# Altium project MSXII_DriverControls_Peripheral.PrjPcb
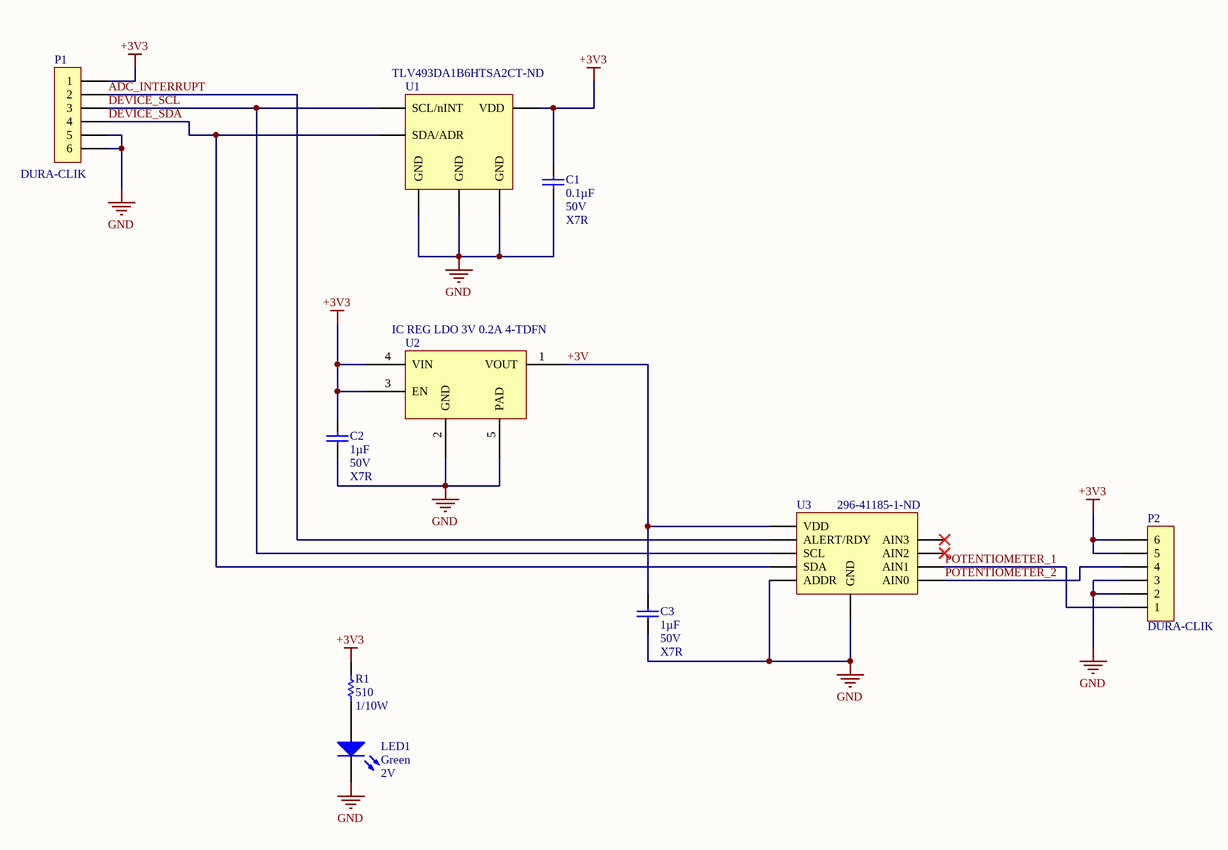
[diagram p0: DriverControls_PeripheralMain.SchDoc]
2 sheets, 10 parts. Net scope: global (net labels, ports and power ports of the same name join across sheets).
Board file: DriverControls_PeripheralPCB.PcbDoc
Sheets:
  DriverControls_PeripheralMain.SchDoc
  DriverControls_PeriphealBlockDiagram.SchDoc

## Sheet DriverControls_PeripheralMain.SchDoc: Peripheral Board
size Letter; Revision: 1.23; SheetNumber: 2; SheetTotal: 2

### Parts
C1  Capacitance: 0.1µF  Voltage: 50V  Temperature Coefficient: X7R  [CAP, 0603]  (hidden comment: CAP CER 0.1UF 50V 10% X7R 0603)
C2  Capacitance: 1µF  Voltage: 50V  Temperature Coefficient: X7R  [CAP, 0603]  (hidden comment: CAP CER 1UF 50V 10% X7R 0603)
C3  Capacitance: 1µF  Voltage: 50V  Temperature Coefficient: X7R  [CAP, 0603]  (hidden comment: CAP CER 1UF 50V 10% X7R 0603)
LED1  Color: Green  Voltage - Forward (Vf) (Typ): 2V  [LED_0603]  (hidden comment: LED GREEN CLEAR 2V 0603)
P1  DURA-CLIK  [CONN, 6POS DURA-CLIK VERT]
P2  DURA-CLIK  [CONN, 6POS DURA-CLIK VERT]
R1  Resistance: 510  Power: 1/10W  [RES, 0603]  (hidden comment: RES 510 OHM 5% 1/10W 0603)
U1  Supplier Part Number 1: TLV493DA1B6HTSA2CT-ND  [IC TLV496D MAG SENSOR TSOP-6]  (hidden comment: HALL EFFECT)
U2  IC REG LDO 3V 0.2A 4-TDFN  [IC REG LDO 3V 0.2A 4-TDFN]
U3  Supplier Part Number 1: 296-41185-1-ND  [IC ADC VSSOP10]  (hidden comment: Quad ADC)

### Nets
+3V3: C1.1 C2.1 P1.1 P2.5 P2.6 R1.1 U1.4(VDD) U2.3(EN) U2.4(VIN)
GND: C1.2 C2.2 C3.2 LED1.2(K) P1.5 P1.6 P2.2 P2.3 U1.2(GND) U1.3(GND) U1.5(GND) U2.2(GND) U2.5(PAD) U3.1(ADDR) U3.3(GND)
+3V: C3.1 U2.1(VOUT) U3.8(VDD)
ADC_INTERRUPT: P1.2 U3.2(ALERT/RDY)
DEVICE_SCL: P1.3 U1.1(SCL/nINT) U3.10(SCL)
DEVICE_SDA: P1.4 U1.6(SDA/ADR) U3.9(SDA)
POTENTIOMETER_1: P2.1 U3.5(AIN1)
POTENTIOMETER_2: P2.4 U3.4(AIN0)
NetLED1_1: LED1.1(A) R1.2

Not connected (* = marked no-connect by the designer): U3 6(AIN2)* 7(AIN3)*

### Notes on the sheet
- Project:
- Title:
- Size:
- Project Lead:
- Letter
- Revision:
- University of Waterloo
- 200 University Ave W
- Waterloo, ON, Canada
- N2L 3E9
- Date:
- Sheet
- of
- Website:

### Library data of the parts
C1 = CAP CER 0.1UF 50V 10% X7R 0603: 0.10µF ±10% 50V Ceramic Capacitor X7R 0603 (1608 Metric); Manufacturer 1: AVX Corporation; Manufacturer Part Number 1: 06035C104KAT2A; Supplier 1: Digi-Key; Supplier Part Number 1: 478-5052-1-ND; Packaging: Cut Tape (CT); Part Status: Active; Operating Temperature: -55°C ~ 125°C; Ratings: -; Mounting Type: Surface Mount, MLCC; Package / Case: 0603 (1608 Metric); Size / Dimension: 0.063" L x 0.032" W (1.60mm x 0.81mm); Height - Seated (Max): -; Thickness (Max): 0.035" (0.90mm); Lead Spacing: -; Lead Style: -; ComponentLink1URL: http://datasheets.avx.com/X7RDielectric.pdf; ComponentLink1Description: http://datasheets.avx.com/X7RDielectric.pdf; Tolerance: ±10%
C2 C3 = CAP CER 1UF 50V 10% X7R 0603: 1µF ±10% 50V Ceramic Capacitor X7R 0603 (1608 Metric); Manufacturer 1: Taiyo Yuden; Manufacturer Part Number 1: UMK107AB7105KA-T; Supplier 1: Digi-Key; Supplier Part Number 1: 587-3247-1-ND; Packaging: Cut Tape (CT); Part Status: Active; Operating Temperature: -55°C ~ 125°C; Ratings: -; Mounting Type: Surface Mount, MLCC; Package / Case: 0603 (1608 Metric); Size / Dimension: 0.063" L x 0.031" W (1.60mm x 0.80mm); Height - Seated (Max): -; Thickness (Max): 0.037" (0.95mm); Lead Spacing: -; Lead Style: -; ComponentLink1URL: http://www.yuden.co.jp/productdata/catalog/en/mlcc_all_e.pdf; ComponentLink1Description: http://www.yuden.co.jp/productdata/catalog/en/mlcc_all_e.pdf; Tolerance: ±10%
LED1 = LED GREEN CLEAR 2V 0603: Green 572nm LED Indication - Discrete 2V 0603 (1608 Metric); Manufacturer: Wurth Electronics Inc.; Manufacturer Part Number: 150060VS75000; Lens Color: Colorless; Millicandela Rating: 40mcd; Lens Style/Size: Rectangle with Flat Top, 1.10mm x 0.70mm; Current - Test: 20mA; Viewing Angle: 140°; Wavelength - Dominant: 570nm; Supplier 1: Digi-Key; RoHS: RoHS Compliant; Category: Optoelectronics; Stock 1: 9408; Pricing 1: 1=0.21, 100=0.1617, 500=0.13964 (CAD); Packaging: Cut Tape (CT); Part Status: Active; Lens Transparency: Clear; Mounting Type: Surface Mount; Wavelength - Peak: 572nm; Features: -; Package / Case: 0603 (1608 Metric); Supplier Device Package: 0603; Size / Dimension: 1.60mm L x 0.80mm W; Height (Max): 0.80mm; ComponentLink1URL: http://katalog.we-online.de/led/datasheet/150060VS75000.pdf; ComponentLink1Description: http://katalog.we-online.de/led/datasheet/150060VS75000.pdf; Supplier Part Number 1: 732-4980-1-ND
P1 P2 = CONN 6POS DURA-CLIK 0.079": 6 Positions Header, Shrouded Connector 0.079" (2.00mm) Surface Mount, Vertical Tin; Manufacturer: Molex; Manufacturer Part Number: 5600200820; Style: Board to Cable/Wire; Shrouding: Shrouded - 4 Wall; Number of Positions: 6; Number of Positions Loaded: All; Mated Stacking Heights: 9.3mm; Supplier 1: Digi-Key; Supplier Part Number 1: WM10866CT-ND; RoHS: RoHS Compliant; Category: Connectors, Interconnects; Stock 1: 3826; Pricing 1: 1=1.76, 10=1.542, 25=1.4512, 50=1.391, 100=1.3305, 250=1.20956 (CAD); Packaging: Cut Tape (CT); Part Status: Active; Connector Type: Header; Contact Type: Male Pin; Pitch - Mating: 0.079" (2.00mm); Number of Rows: 1; Row Spacing - Mating: -; Mounting Type: Surface Mount; Termination: Solder; Fastening Type: Latch Lock; Contact Length - Mating: -; Contact Length - Post: -; Overall Contact Length: -; Insulation Height: 0.315" (8.00mm); Contact Shape: Square; Contact Finish - Mating: Tin; Contact Finish Thickness - Mating: -; Contact Finish - Post: Tin; Contact Material: Copper Alloy; Insulation Material: Polyamide (PA), Nylon; Features: Solder Retention; Operating Temperature: -; Ingress Protection: -; Material Flammability Rating: -; Insulation Color: Natural; Current Rating: -; Voltage Rating: -; Contact Finish Thickness - Post: -; Applications: Automotive, Industrial; ComponentLink1URL: http://www.molex.com/pdm_docs/sd/5600200220_sd.pdf; ComponentLink1Description: http://www.molex.com/pdm_docs/sd/5600200220_sd.pdf
R1 = RES 510 OHM 5% 1/10W 0603: RES SMD 510 OHM 5% 1/10W 0603; Manufacturer 1: Yageo; Manufacturer Part Number 1: RC0603JR-07510RL; Temperature Coefficient: ±100ppm/°C; Supplier 1: Digi-Key; Supplier Part Number 1: 311-510GRCT-ND; Packaging: Cut Tape (CT); Part Status: Active; Composition: Thick Film; Operating Temperature: -55°C ~ 155°C; Package / Case: 0603 (1608 Metric); Supplier Device Package: 0603; Size / Dimension: 0.063" L x 0.031" W (1.60mm x 0.80mm); Height - Seated (Max): 0.022" (0.55mm); Failure Rate: -; ComponentLink1URL: http://www.yageo.com/documents/recent/PYu-RC_Group_51_RoHS_L_7.pdf; ComponentLink1Description: http://www.yageo.com/documents/recent/PYu-RC_Group_51_RoHS_L_7.pdf; Tolerance: ±5%
U1 = IC SENSOR HALL I2C TSOP-6: Hall Effect Sensor Linear, Rotary Position External Magnet Not Included SMD (SMT) Tab; Manufacturer: Infineon Technologies; Manufacturer Part Number: TLV493DA1B6HTSA2; Rotation Angle - Electrical, Mechanical: 0° ~ 360°, Continuous; Output: I²C; Voltage - Supply: 2.7 V ~ 3.5 V; Supplier 1: Digi-Key; RoHS: RoHS Compliant; Category: Sensors, Transducers; Stock 1: 8466; Pricing 1: 1=2.75, 5=2.654, 10=2.155, 25=1.8564, 50=1.608, 100=1.4587, 500=1.22668, 1000=1.09407 (CAD); Part Status: Active; For Measuring: Linear, Rotary Position; Technology: Hall Effect; Linear Range: -; Output Signal: -; Actuator Type: External Magnet Not Included; Linearity: -; Resistance (Ohms): -; Resistance Tolerance: -; Mounting Type: Surface Mount; Termination Style: SMD (SMT) Tab; Operating Temperature: -40°C ~ 125°C; ComponentLink1URL: http://www.infineon.com/dgdl/Infineon-TLV493D-A1B6-DS-v01_00-EN.pdf?fileId=5546d462525dbac40152a6b85c760e80; ComponentLink1Description: http://www.infineon.com/dgdl/Infineon-TLV493D-A1B6-DS-v01_00-EN.pdf?fileId=5546d462525dbac40152a6b85c760e80
U2 = IC REG LDO 3V 0.2A 4-TDFN: Manufacturer: Microchip Technology; Manufacturer Part Number: MIC94310-PYMT-TR; Regulator Topology: Positive Fixed; Current - Output: 200mA; Voltage - Dropout (Typical): 0.04V @ 200mA; Voltage - Input: Up to 3.6V; Current - Limit (Min): 250mA; Supplier 1: Digi-Key; RoHS: RoHS Compliant; Category: Integrated Circuits (ICs); Stock 1: 4802; Pricing 1: 1=0.45, 25=0.3708, 100=0.3386 (CAD); Packaging: Cut Tape (CT); Part Status: Active; Voltage - Output: 3V; Operating Temperature: -40°C ~ 125°C; Mounting Type: Surface Mount; Package / Case: 4-UFDFN Exposed Pad; Supplier Device Package: 4-TDFN (1.2x1.6); ComponentLink1URL: http://www.microchip.com/mymicrochip/filehandler.aspx?ddocname=en580409; ComponentLink1Description: http://www.microchip.com/mymicrochip/filehandler.aspx?ddocname=en580409; Supplier Part Number 1: 576-4761-1-ND
U3 = IC ADC 12-BIT VSSOP-10: 12 Bit Analog to Digital Converter 4 Input 1 Sigma-Delta 10-VSSOP; Manufacturer: Texas Instruments; Manufacturer Part Number: ADS1015IDGSR; Number of Bits: 12; Sampling Rate (Per Second): 3.3k; Number of Inputs: 2, 4; Input Type: Differential, Single Ended; Data Interface: I²C; Configuration: MUX-PGA-ADC; Number of A/D Converters: 1; Reference Type: Internal; Voltage - Supply, Analog: 2 V ~ 5.5 V; Supplier 1: Digi-Key; RoHS: RoHS Compliant; Category: Integrated Circuits (ICs); Stock 1: 4084; Pricing 1: 1=4.25, 10=3.807, 100=3.1194, 500=2.65552, 1000=2.23959 (CAD); Packaging: Cut Tape (CT); Part Status: Active; Ratio - S/H:ADC: -; Architecture: Sigma-Delta; Voltage - Supply, Digital: 2 V ~ 5.5 V; Features: PGA, Selectable Address; Operating Temperature: -40°C ~ 125°C; Package / Case: 10-TFSOP, 10-MSOP (0.118", 3.00mm Width); Supplier Device Package: 10-VSSOP; ComponentLink1URL: http://www.ti.com/lit/ds/symlink/ads1013.pdf; ComponentLink1Description: http://www.ti.com/lit/ds/symlink/ads1013.pdf

## Sheet DriverControls_PeriphealBlockDiagram.SchDoc: Block Diagram
size Letter; Revision: 1.23; SheetNumber: 1; SheetTotal: 2
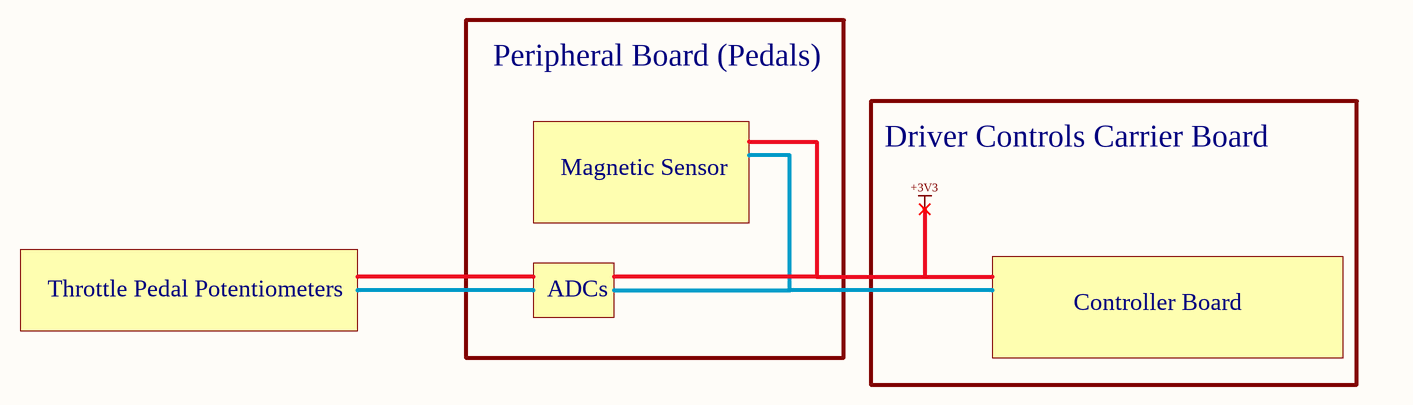
[diagram p1: DriverControls_PeriphealBlockDiagram.SchDoc]

### Notes on the sheet
- Peripheral Board (Pedals)
- Magnetic Sensor
- Driver Controls Carrier Board
- Throttle Pedal Potentiometers
- ADCs
- Controller Board
- Labels drawn without touching a wire or pin: +3V3
- Project:
- Title:
- Size:
- Project Lead:
- Letter
- Revision:
- University of Waterloo
- 200 University Ave W
- Waterloo, ON, Canada
- N2L 3E9
- Date:
- Sheet
- of
- Website:

## Assembly variants
With_ADC: all parts fitted
No_ADC: not fitted C2 C3 P2 U2 U3